# Altium schematic sheet [07] - USB HUB.SchDoc: USB HUB
size A4; Organization: Bjørn T. Brodtkorb; Address1: Frode Rinnans veg 161; Address2: 7050 Trondheim; DocumentNumber: 6598; Revision: 1.0; SheetNumber: 1; SheetTotal: 1
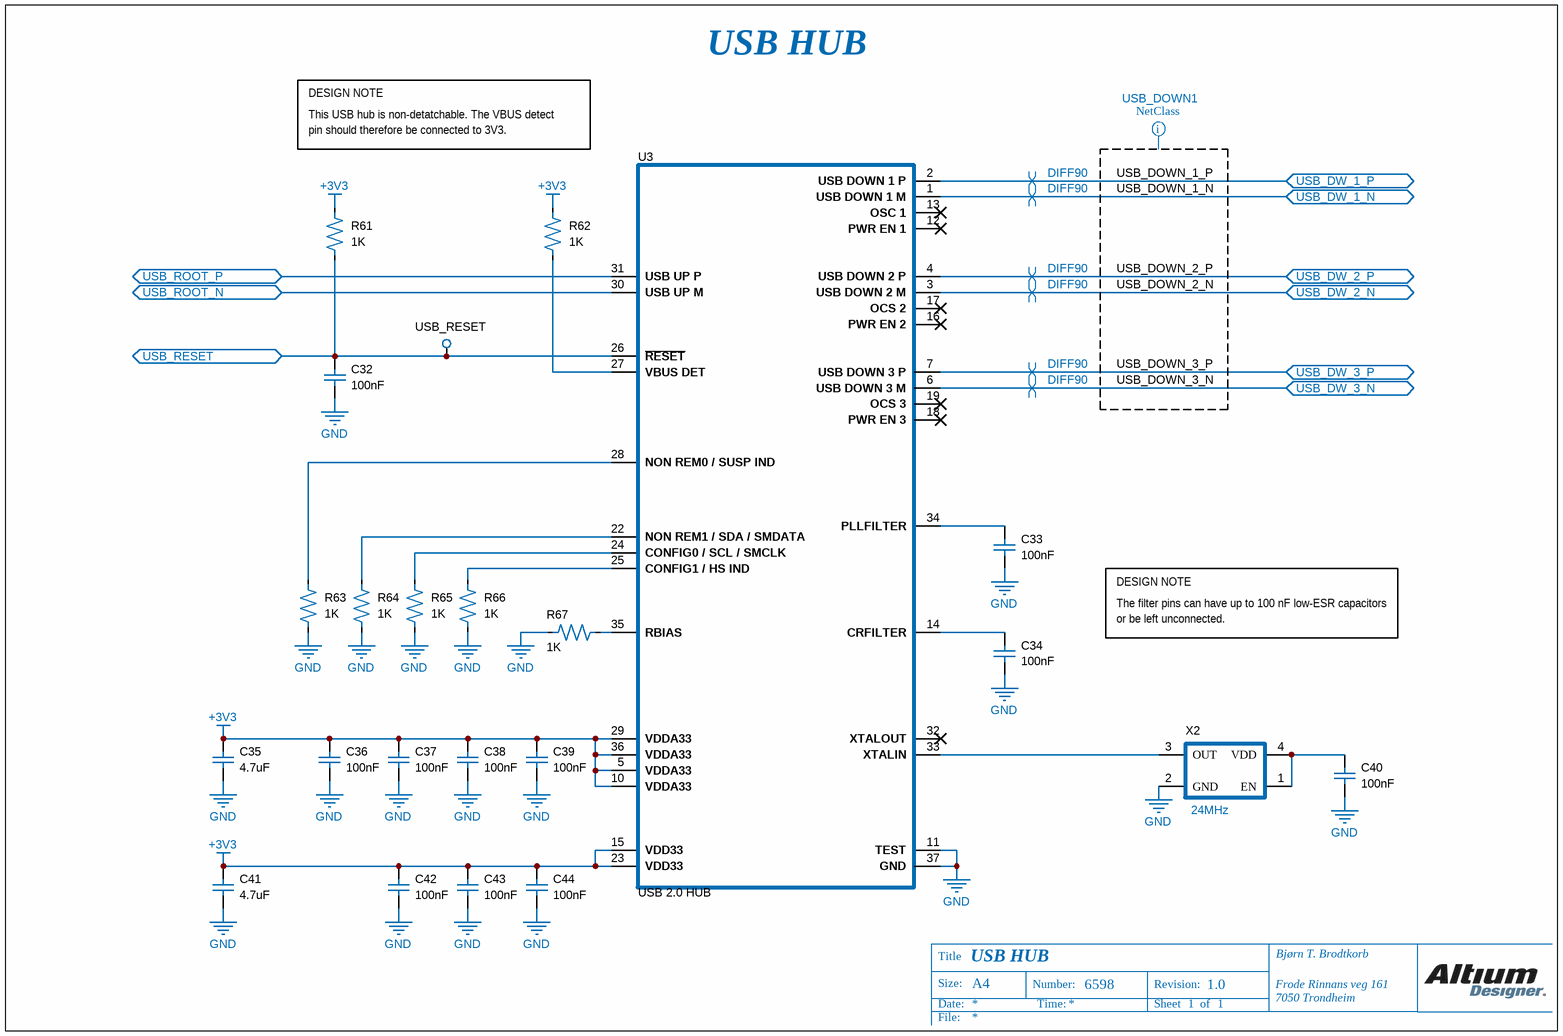
[diagram p0: [07] - USB HUB.SchDoc]

## Parts
C32  value 100nF  [C0402]  (hidden comment: 04023C103KAT2A)
C33  value 100nF  [C0402]  (hidden comment: 04023C103KAT2A)
C34  value 100nF  [C0402]  (hidden comment: 04023C103KAT2A)
C35  value 4.7uF  [C0603]  (hidden comment: 02016D104KAT2A)
C36  value 100nF  [C0402]  (hidden comment: 04023C103KAT2A)
C37  value 100nF  [C0402]  (hidden comment: 04023C103KAT2A)
C38  value 100nF  [C0402]  (hidden comment: 04023C103KAT2A)
C39  value 100nF  [C0402]  (hidden comment: 04023C103KAT2A)
C40  value 100nF  [C0402]  (hidden comment: 04023C103KAT2A)
C41  value 4.7uF  [C0603]  (hidden comment: 02016D104KAT2A)
C42  value 100nF  [C0402]  (hidden comment: 04023C103KAT2A)
C43  value 100nF  [C0402]  (hidden comment: 04023C103KAT2A)
C44  value 100nF  [C0402]  (hidden comment: 04023C103KAT2A)
R61  value 1K  [R0402]  (hidden comment: CRCW04020000Z0ED)
R62  value 1K  [R0402]  (hidden comment: CRCW04020000Z0ED)
R63  value 1K  [R0402]  (hidden comment: CRCW04020000Z0ED)
R64  value 1K  [R0402]  (hidden comment: CRCW04020000Z0ED)
R65  value 1K  [R0402]  (hidden comment: CRCW04020000Z0ED)
R66  value 1K  [R0402]  (hidden comment: CRCW04020000Z0ED)
R67  value 1K  [R0402]  (hidden comment: CRCW04020000Z0ED)
TP3  Type: USB_RESET  [TEST POINT]  (hidden comment: Test point)
U3  USB 2.0 HUB  [USB2512B-I/M2]
X2  value 24MHz  [MCSJK-7U-12.00-12-30-80-B-30]  (hidden comment: X1G0041710031 SG-210STF 24 MHZ L)

## Ports
USB_DW_1_N (bidir), USB_DW_1_P (bidir), USB_DW_2_N (bidir), USB_DW_2_P (bidir), USB_DW_3_N (bidir), USB_DW_3_P (bidir), USB_RESET (bidir), USB_ROOT_N (bidir), USB_ROOT_P (bidir)

## Nets
+3V3: C35.1 C36.2 C37.2 C38.2 C39.2 C41.1 C42.2 C43.2 C44.2 R61.2 R62.2 U3.5(VDDA33) U3.10(VDDA33) U3.15(VDD33) U3.23(VDD33) U3.29(VDDA33) U3.36(VDDA33)
GND: C32.1 C33.1 C34.1 C35.2 C36.1 C37.1 C38.1 C39.1 C40.1 C41.2 C42.1 C43.1 C44.1 R63.1 R64.1 R65.1 R66.1 R67.1 U3.11(TEST) U3.37(GND) X2.2(GND)
USB_DOWN_1_N: U3.1(USB_DOWN_1_M) ; port USB_DW_1_N
USB_DOWN_1_P: U3.2(USB_DOWN_1_P) ; port USB_DW_1_P
USB_DOWN_2_N: U3.3(USB_DOWN_2_M) ; port USB_DW_2_N
USB_DOWN_2_P: U3.4(USB_DOWN_2_P) ; port USB_DW_2_P
USB_DOWN_3_N: U3.6(USB_DOWN_3_M) ; port USB_DW_3_N
USB_DOWN_3_P: U3.7(USB_DOWN_3_P) ; port USB_DW_3_P
USB_RESET: C32.2 R61.1 TP3.1 U3.26(~{RESET}) ; port USB_RESET
USB_ROOT_N: U3.30(USB_UP_M) ; port USB_ROOT_N
USB_ROOT_P: U3.31(USB_UP_P) ; port USB_ROOT_P
NetC33_2: C33.2 U3.34(PLLFILTER)
NetC34_2: C34.2 U3.14(CRFILTER)
NetC40_2: C40.2 X2.1(EN) X2.4(VDD)
NetR62_1: R62.1 U3.27(VBUS_DET)
NetR63_2: R63.2 U3.28(NON_REM0_/_SUSP_IND)
NetR64_2: R64.2 U3.22(NON_REM1_/_SDA_/_SMDATA)
NetR65_2: R65.2 U3.24(CONFIG0_/_SCL_/_SMCLK)
NetR66_2: R66.2 U3.25(CONFIG1_/_HS_IND)
NetR67_2: R67.2 U3.35(RBIAS)
NetU3_33: U3.33(XTALIN) X2.3(OUT)

Not connected (* = marked no-connect by the designer): U3 12(PWR_EN_1)* 13(OSC_1)* 16(PWR_EN_2)* 17(OCS_2)* 18(PWR_EN_3)* 19(OCS_3)* 32(XTALOUT)*

## Layout directives
differential pair; differential pair class DIFF90: USB_DOWN_1_N, USB_DOWN_1_P, USB_DOWN_2_N, USB_DOWN_2_P, USB_DOWN_3_N, USB_DOWN_3_P
net class USB_DOWN1: USB_DOWN_1_N, USB_DOWN_1_P, USB_DOWN_2_N, USB_DOWN_2_P, USB_DOWN_3_N, USB_DOWN_3_P

## Notes on the sheet
- DESIGN NOTE
- USB HUB
- This USB hub is non-detatchable. The VBUS detect
- pin should therefore be connected to 3V3.
- The filter pins can have up to 100 nF low-ESR capacitors
- or be left unconnected.
- Title
- Size:
- A4
- Number:
- Revision:
- Date:
- File:
- Time:
- Sheet
- of

## Library data of the parts
C32-C34 C36-C40 C42-C44 = 04023C103KAT2A: C0402
C35 C41 = 02016D104KAT2A: C0603
R61-R67 = CRCW04020000Z0ED: R0402
U3 = USB2513B-I/M2: USB 2.0 Hub 3x ports; Supplier 1: Farnell; Supplier Part Number 1: 456
X2 = X1G0041710031 SG-210STF 24 MHZ L: Oscillator 3.2mm x 2.5mm